# EAGLE design ALU-register (EAGLE 9.6.2)
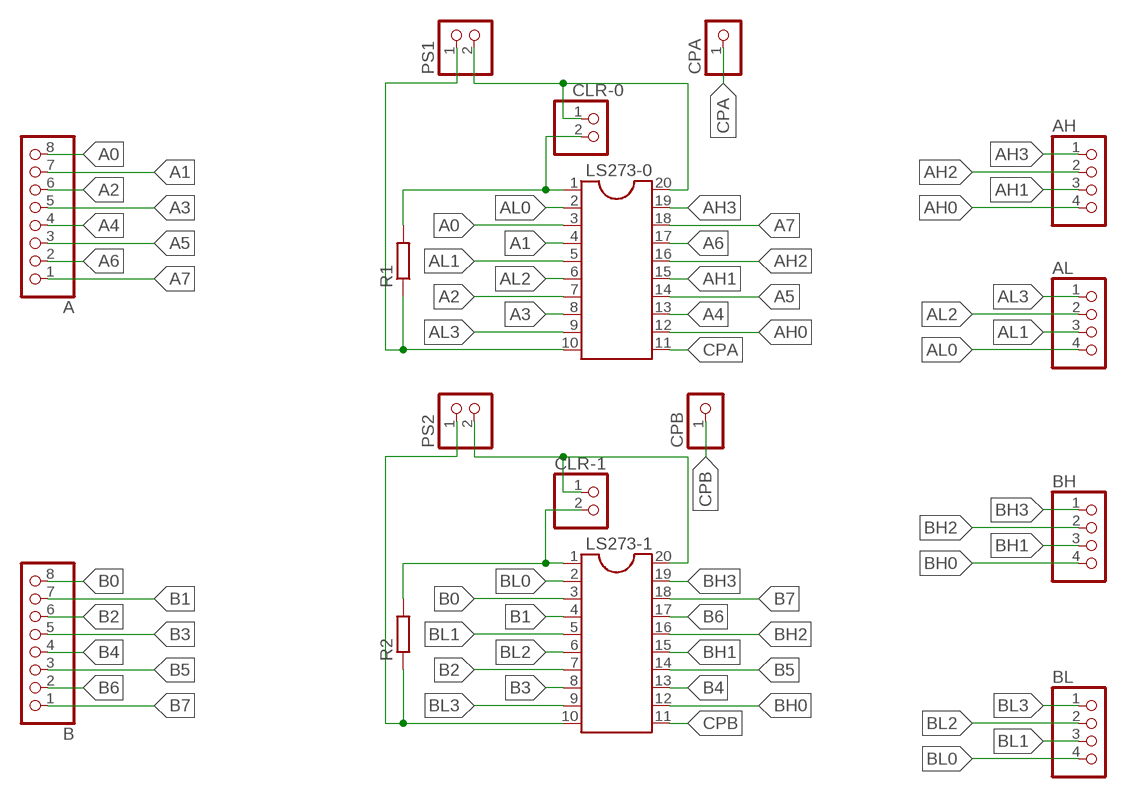
[diagram p0: schematic, sheet 1]

## Parts
A  PINHD-1X8  [1X08]
AH  PINHD-1X4  [1X04]
AL  PINHD-1X4  [1X04]
B  PINHD-1X8  [1X08]
BH  PINHD-1X4  [1X04]
BL  PINHD-1X4  [1X04]
CLR-0  PINHD-1X2  [1X02]
CLR-1  PINHD-1X2  [1X02]
CPA  PINHD-1X1  [1X01]
CPB  PINHD-1X1  [1X01]
LS273-0  DIL20S  [SOCKET-20]
LS273-1  DIL20S  [SOCKET-20]
PS1  PINHD-1X2  [1X02]
PS2  PINHD-1X2  [1X02]
R1  R-EU_0204/7  [0204/7]
R2  R-EU_0204/7  [0204/7]

## Nets
A0: A.8 LS273-0.3
A1: A.7 LS273-0.4
A2: A.6 LS273-0.7
A3: A.5 LS273-0.8
A4: A.4 LS273-0.13
A5: A.3 LS273-0.14
A6: A.2 LS273-0.17
A7: A.1 LS273-0.18
AH0: AH.4 LS273-0.12
AH1: AH.3 LS273-0.15
AH2: AH.2 LS273-0.16
AH3: AH.1 LS273-0.19
AL0: AL.4 LS273-0.2
AL1: AL.3 LS273-0.5
AL2: AL.2 LS273-0.6
AL3: AL.1 LS273-0.9
B0: B.8 LS273-1.3
B1: B.7 LS273-1.4
B2: B.6 LS273-1.7
B3: B.5 LS273-1.8
B4: B.4 LS273-1.13
B5: B.3 LS273-1.14
B6: B.2 LS273-1.17
B7: B.1 LS273-1.18
BH0: BH.4 LS273-1.12
BH1: BH.3 LS273-1.15
BH2: BH.2 LS273-1.16
BH3: BH.1 LS273-1.19
BL0: BL.4 LS273-1.2
BL1: BL.3 LS273-1.5
BL2: BL.2 LS273-1.6
BL3: BL.1 LS273-1.9
CPA: CPA.1 LS273-0.11
CPB: CPB.1 LS273-1.11
GND1: LS273-0.10 PS1.1 R1.1
GND2: LS273-1.10 PS2.1 R2.1
N$1: CLR-0.2 LS273-0.1 R1.2
N$4: CLR-1.2 LS273-1.1 R2.2
VCC1: CLR-0.1 LS273-0.20 PS1.2
VCC2: CLR-1.1 LS273-1.20 PS2.2

## Library data of the parts
A B = pinhead:PINHD-1X8: PIN HEADER
AH AL BH BL = pinhead:PINHD-1X4: PIN HEADER
CLR-0 CLR-1 PS1 PS2 = pinhead:PINHD-1X2: PIN HEADER
CPA CPB = pinhead:PINHD-1X1: PIN HEADER
LS273-0 LS273-1 = ic-package:DIL20: Dual In Line / Socket
R1 R2 = rcl:R-EU_: RESISTOR, European symbol; SPICEPREFIX: R

## Board
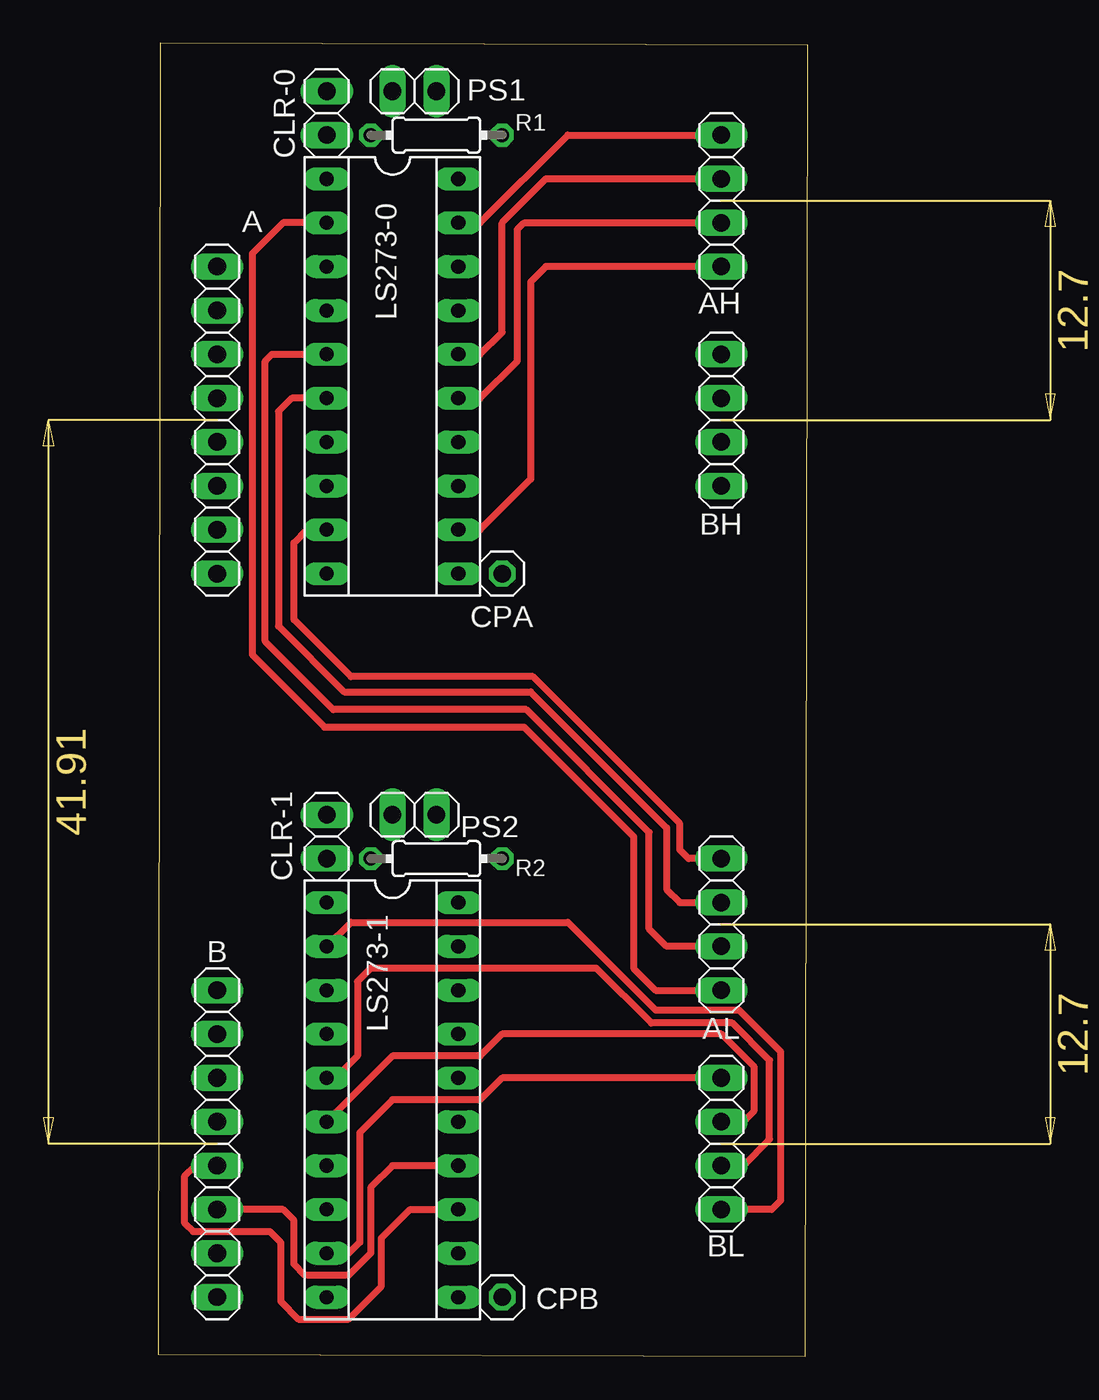
[diagram p1: board, top side]
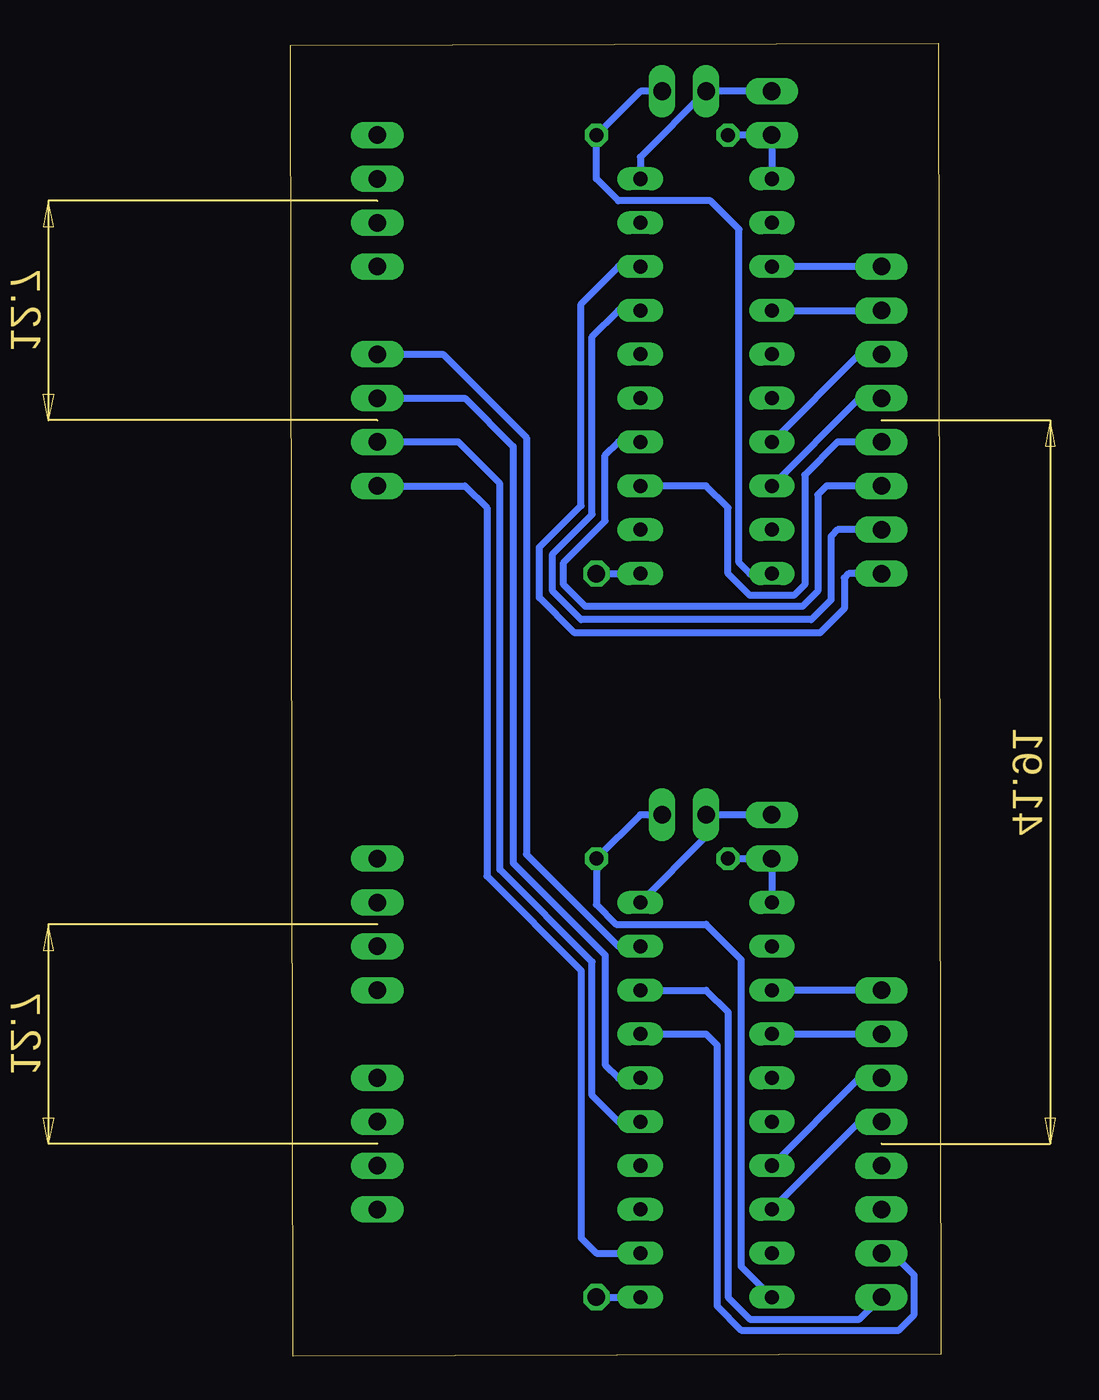
[diagram p2: board, bottom side, seen from below]

Size 37.64 x 76.06 mm. Coordinates in mm from the lower left corner, seen from the top.
Outline: 0,0.13 37.52,0 37.64,75.94 0.13,76.06 0,0.13
Copper layers (1*16): Top 0.035mm / dielectric 1.5mm / Bottom 0.035mm
Design rules "default": minimum track width 6mil, minimum drill 0.35mm, track to track 6mil, track to pad 6mil, pad to pad 6mil, via to via 6mil, smd to smd 6mil, copper to edge 40mil, drill to drill 6mil, minimum pad ring 10mil, minimum via ring 8mil, stop-mask expansion 4mil, vias tented up to drill 0mil, thermal gap 10mil

### Footprints (pad centres in the part's own frame; a part is rotated, then mirrored left to right if it is on the bottom)
1X08 = drill 1.016 long: 1 -8.89,0; 2 -6.35,0; 3 -3.81,0; 4 -1.27,0; 5 1.27,0; 6 3.81,0; 7 6.35,0; 8 8.89,0
1X04 = drill 1.016 long: 1 -3.81,0; 2 -1.27,0; 3 1.27,0; 4 3.81,0
1X02 = drill 1.016 long: 1 -1.27,0; 2 1.27,0
1X01 = drill 1.016 octagon: 1 0,0
SOCKET-20 = drill 0.813 long: 1 -11.43,-3.81; 2 -8.89,-3.81; 3 -6.35,-3.81; 4 -3.81,-3.81; 5 -1.27,-3.81; 6 1.27,-3.81; 7 3.81,-3.81; 8 6.35,-3.81; 9 8.89,-3.81; 10 11.43,-3.81; 11 11.43,3.81; 12 8.89,3.81; 13 6.35,3.81; 14 3.81,3.81; 15 1.27,3.81; 16 -1.27,3.81; 17 -3.81,3.81; 18 -6.35,3.81; 19 -8.89,3.81; 20 -11.43,3.81
0204/7 = drill 0.813 octagon: 1 -3.81,0; 2 3.81,0

### Placement (x,y rotation side)
A  3.43,54.23 90 top
AH  32.64,66.93 270 top
AL  32.64,25.02 270 top
B  3.43,12.32 90 top
BH  32.64,54.23 270 top
BL  32.64,12.32 270 top
CLR-0  9.78,72.01 270 top
CLR-1  9.78,30.1 270 top
CPA  19.94,45.34 0 top
CPB  19.94,3.43 0 top
LS273-0  13.59,56.77 270 top
LS273-1  13.59,14.86 270 top
PS1  14.86,73.28 180 top
PS2  14.86,31.37 180 top
R1  16.13,70.74 180 top
R2  16.13,28.83 180 top

### Tracks (layer width: path | path; a pad name or v marks a point on that pad's centre or on a via)
A0
  Bottom 0.4: A.8 LS273-0.3
A1
  Bottom 0.4: LS273-0.4 A.7
A2
  Bottom 0.4: A.6 4.7,58.04 LS273-0.7
A3
  Bottom 0.4: LS273-0.8 4.7,55.5 A.5
A4
  Bottom 0.4: A.4 5.97,52.96 7.87,51.05 7.87,44.7 8.51,44.07 11.05,44.07 12.32,45.34 12.32,49.15 13.59,50.42 LS273-0.13
A5
  Bottom 0.4: LS273-0.14 18.67,52.96 19.43,52.2 19.43,48.39 21.84,45.97 21.84,44.7 20.57,43.43 8,43.43 7.11,44.32 7.11,49.91 6.6,50.42 A.3
A6
  Bottom 0.4: LS273-0.17 18.67,60.58 20.19,59.05 20.19,48.77 22.48,46.48 22.48,44.32 20.83,42.67 7.49,42.67 6.35,43.82 6.35,47.5 5.97,47.88 A.2
A7
  Bottom 0.4: LS273-0.18 18.67,63.12 20.83,60.96 20.83,49.28 23.24,46.86 23.24,43.94 21.21,41.91 6.99,41.91 5.59,43.31 5.59,45.09 5.33,45.34 A.1
AH0
  Top 0.4: AH.4 22.48,63.12 21.59,62.23 21.59,50.8 18.67,47.88 LS273-0.12
AH1
  Top 0.4: LS273-0.15 18.67,55.5 20.83,57.66 20.83,65.28 21.21,65.66 AH.3
AH2
  Top 0.4: LS273-0.16 18.67,58.04 19.94,59.31 19.94,65.66 22.48,68.2 AH.2
AH3
  Top 0.4: LS273-0.19 18.67,65.66 23.75,70.74 AH.1
AL0
  Top 0.4: LS273-0.2 7.24,65.66 5.46,63.88 5.46,40.64 9.65,36.45 21.21,36.45 27.56,30.1 27.56,22.48 28.83,21.21 AL.4
AL1
  Top 0.4: LS273-0.5 6.6,58.04 6.22,57.66 6.22,41.4 10.16,37.47 21.34,37.47 28.45,30.35 28.45,24.77 29.46,23.75 AL.3
AL2
  Top 0.4: AL.2 30.23,26.29 29.46,27.05 29.46,30.61 21.59,38.48 10.79,38.48 6.99,42.29 6.99,54.74 7.75,55.5 LS273-0.6
AL3
  Top 0.4: LS273-0.9 8.64,47.88 7.87,47.12 7.87,42.67 11.18,39.37 21.72,39.37 30.23,30.86 30.23,29.34 30.73,28.83 AL.1
B0
  Bottom 0.4: B.8 LS273-1.3
B1
  Bottom 0.4: LS273-1.4 B.7
B2
  Bottom 0.4: LS273-1.7 4.7,16.13 B.6
B3
  Bottom 0.4: B.5 4.7,13.59 LS273-1.8
B4
  Top 0.4: B.4 2.16,11.05 1.52,10.41 1.52,7.75 2.03,7.24 6.48,7.24 7.11,6.6 7.11,3.17 8.13,2.16 11.05,2.16 12.95,4.06 12.95,6.86 14.61,8.51 LS273-1.13
B5
  Top 0.4: LS273-1.14 13.59,11.05 12.32,9.78 12.32,5.97 11.05,4.7 8.51,4.7 7.87,5.33 7.87,7.87 7.24,8.51 B.3
B6
  Bottom 0.4: LS273-1.17 13.59,18.67 12.95,18.03 12.95,2.92 11.56,1.52 2.41,1.52 1.52,2.41 1.52,4.7 2.79,5.97 B.2
B7
  Bottom 0.4: LS273-1.18 13.59,21.21 12.32,19.94 12.32,3.43 11.05,2.16 4.7,2.16 B.1
BH0
  Bottom 0.4: BH.4 27.56,50.42 26.29,49.15 26.29,27.81 20.83,22.35 20.83,6.86 19.94,5.97 LS273-1.12
BH1
  Bottom 0.4: LS273-1.15 18.67,13.59 20.19,15.11 20.19,22.86 25.53,28.19 25.53,50.55 27.94,52.96 BH.3
BH2
  Bottom 0.4: BH.2 27.56,55.5 24.77,52.71 24.77,28.57 19.43,23.24 19.43,16.89 18.67,16.13 LS273-1.16
BH3
  Bottom 0.4: BH.1 28.83,58.04 24,53.21 24,29.08 18.67,23.75 LS273-1.19
BL0
  Top 0.4: BL.4 35.56,8.51 36.07,9.02 36.07,17.65 33.66,20.07 28.83,20.07 23.75,25.15 11.18,25.15 LS273-1.2
BL1
  Top 0.4: BL.3 33.91,11.05 35.43,12.57 35.43,17.14 33.27,19.3 28.57,19.3 25.4,22.48 12.32,22.48 11.56,21.72 11.56,17.4 10.29,16.13 LS273-1.5
BL2
  Top 0.4: BL.2 33.91,13.59 34.54,14.22 34.54,16.76 32.64,18.67 19.94,18.67 18.67,17.4 13.59,17.4 LS273-1.6
BL3
  Top 0.4: LS273-1.9 11.05,5.97 11.68,6.6 11.68,12.95 13.59,14.86 18.67,14.86 19.94,16.13 BL.1
CPA
  Bottom 0.4: CPA.1 LS273-0.11
CPB
  Bottom 0.4: CPB.1 LS273-1.11
GND1
  Bottom 0.4: PS1.1 17.4,73.28 R1.1 19.94,68.2 18.67,66.93 13.34,66.93 11.68,65.28 11.68,45.97 11.05,45.34 LS273-0.10
GND2
  Bottom 0.4: PS2.1 17.4,31.37 R2.1 19.94,26.16 18.8,25.02 13.59,25.02 11.56,22.99 11.56,5.21 LS273-1.10
N$1
  Bottom 0.4: LS273-0.1 CLR-0.2 R1.2
N$4
  Bottom 0.4: LS273-1.1 CLR-1.2 R2.2
VCC1
  Bottom 0.4: CLR-0.1 PS1.2 17.4,69.47 LS273-0.20
VCC2
  Bottom 0.4: CLR-1.1 PS2.2 13.59,30.1 LS273-1.20